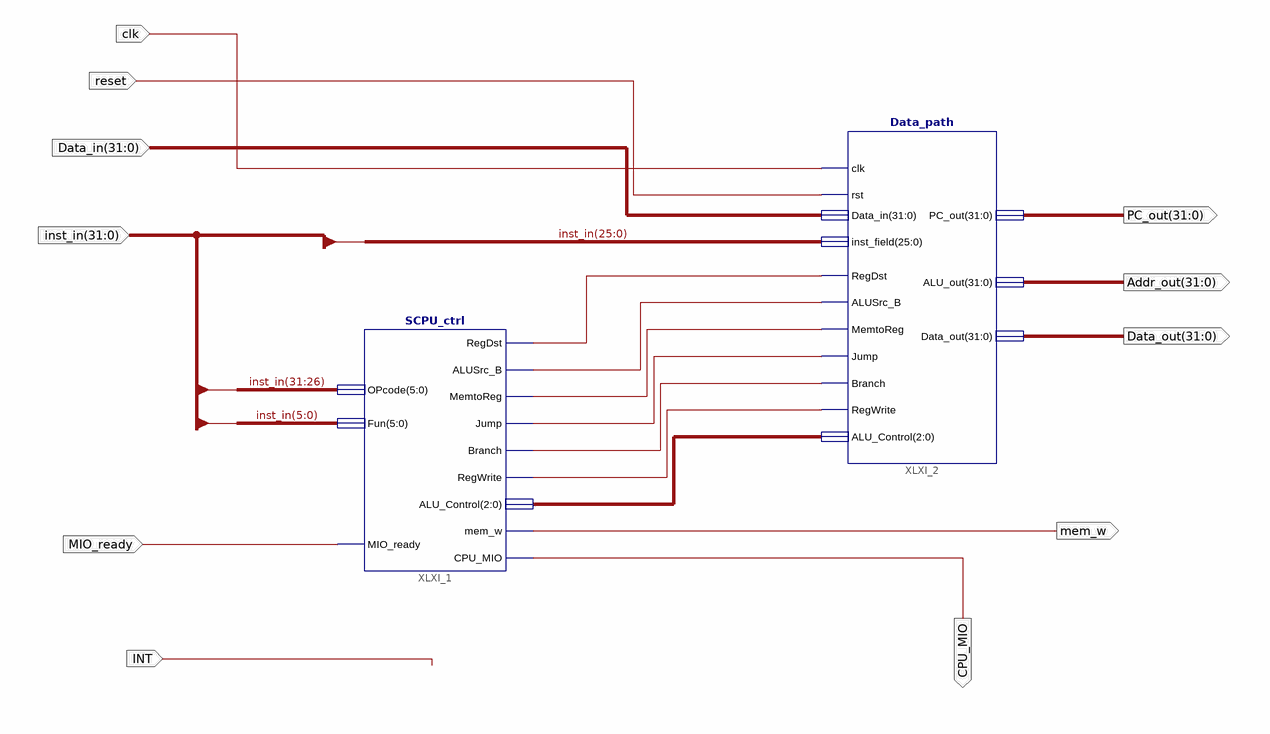
[diagram p0: schematic sheet 1]
// Xilinx ISE schematic SCPU.sch (kintex7) as structural Verilog: 2 symbols, 11 ports
module SCPU (
  input  clk,
  input  reset,
  input  [31:0] Data_in,
  input  [31:0] inst_in,
  input  MIO_ready,
  input  INT,
  output CPU_MIO,
  output mem_w,
  output [31:0] PC_out,
  output [31:0] Addr_out,
  output [31:0] Data_out
);

  wire XLXN_22, XLXN_23, XLXN_24, XLXN_25, XLXN_26, XLXN_28;
  wire [2:0] XLXN_21;

  SCPU_ctrl XLXI_1 (
    .RegDst(XLXN_28), .ALUSrc_B(XLXN_26), .MemtoReg(XLXN_25), .Jump(XLXN_24), .Branch(XLXN_23),
    .RegWrite(XLXN_22), .ALU_Control(XLXN_21), .CPU_MIO(CPU_MIO), .mem_w(mem_w), .Fun(inst_in[5:0]),
    .MIO_ready(MIO_ready), .OPcode(inst_in[31:26]));
  Data_path XLXI_2 (
    .RegDst(XLXN_28), .ALUSrc_B(XLXN_26), .MemtoReg(XLXN_25), .Jump(XLXN_24), .Branch(XLXN_23),
    .RegWrite(XLXN_22), .ALU_Control(XLXN_21), .Data_in(Data_in), .inst_field(inst_in[25:0]), .clk(clk),
    .rst(reset), .PC_out(PC_out), .ALU_out(Addr_out), .Data_out(Data_out));
endmodule
